# EAGLE schematic Tapuino (EAGLE 7.1.0)
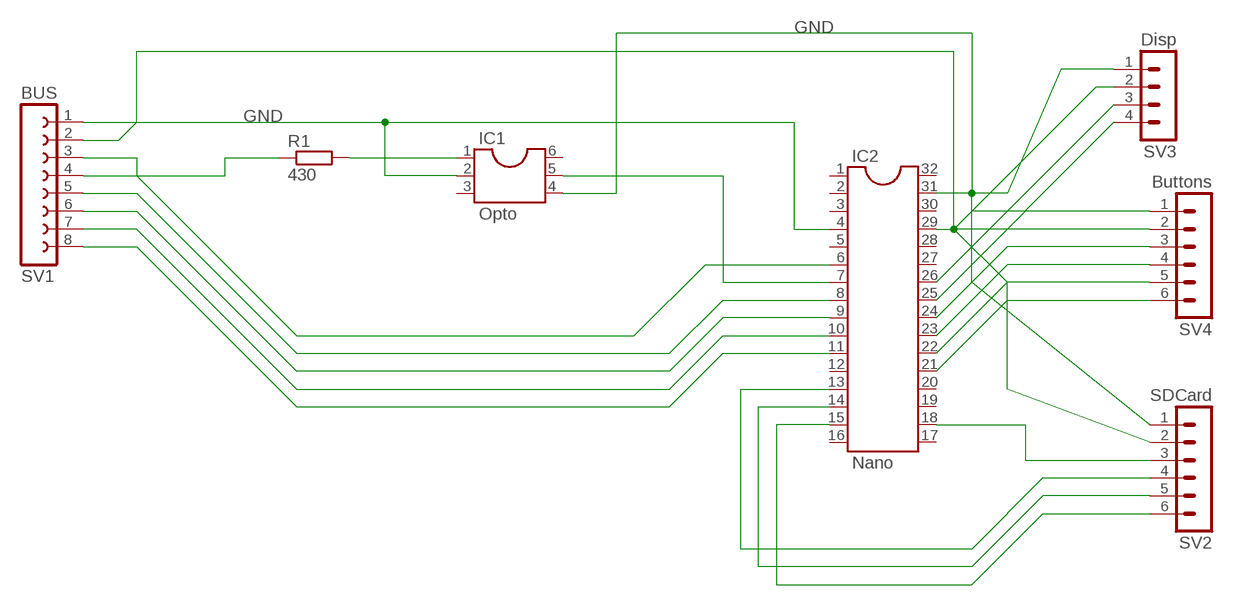
[diagram p0: schematic, sheet 1]

## Parts
IC1  Opto  DIL6  [DIL06]
IC2  Nano  DIL32  [DIL32]
R1  430  R-EU_0207/10  [0207/10]
SV1  BUS  FE08-1  [FE08]
SV2  SDCard  MA06-1  [MA06-1]
SV3  Disp  MA04-1  [MA04-1]
SV4  Buttons  MA06-1  [MA06-1]

## Nets
GND: IC1.2 IC1.4 IC2.4 IC2.31 SV1.1 SV2.1 SV3.1 SV4.1
N$1: R1.1 SV1.4
N$2: IC2.29 SV1.2 SV2.2 SV3.2 SV4.2
N$4: IC2.6 SV1.3
N$5: IC1.1 R1.2
N$6: IC1.5 IC2.7
N$7: IC2.8 SV1.5
N$8: IC2.9 SV1.6
N$9: IC2.10 SV1.7
N$10: IC2.11 SV1.8
N$11: IC2.14 SV2.5
N$12: IC2.15 SV2.6
N$13: IC2.25 SV3.4
N$14: IC2.13 SV2.4
N$16: IC2.24 SV4.3
N$17: IC2.26 SV3.3
N$18: IC2.21 SV4.6
N$19: IC2.23 SV4.4
N$20: IC2.22 SV4.5
N$22: IC2.18 SV2.3
Unconnected: IC1.3 IC1.6 IC2.1 IC2.2 IC2.3 IC2.5 IC2.12 IC2.16 IC2.17 IC2.19 IC2.20 IC2.27 IC2.28 IC2.30 IC2.32

## Library data of the parts
IC1 = ic-package:DIL6: Dual In Line / Socket
IC2 = ic-package:DIL32: Dual In Line
R1 = rcl:R-EU_: RESISTOR, European symbol
SV1 = con-lsta:FE08-1: FEMALE HEADER; OC_FARNELL: unknown; OC_NEWARK: unknown
SV2 SV4 = con-lstb:MA06-1: PIN HEADER; OC_FARNELL: unknown; OC_NEWARK: unknown
SV3 = con-lstb:MA04-1: PIN HEADER; OC_FARNELL: unknown; OC_NEWARK: unknown